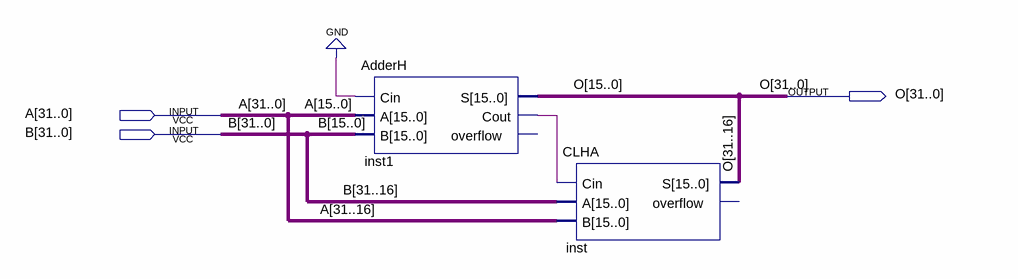
[diagram p0: schematic sheet]
// Quartus schematic Add32.bdf as structural Verilog: 2 symbols, 3 pins
module Add32 (
  input  [31:0] A,
  input  [31:0] B,
  output [31:0] O
);

  wire inst1_cout;

  AdderH inst1 (.Cin(1'b0), .A(A[15:0]), .B(B[15:0]), .S(O[15:0]), .Cout(inst1_cout));  // open: overflow
  CLHA inst (.Cin(inst1_cout), .A(B[31:16]), .B(A[31:16]), .S(O[31:16]));  // open: overflow
endmodule
